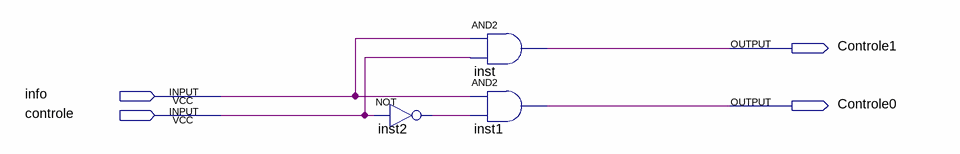
[diagram p0: schematic sheet]
// Quartus schematic Seletor.bdf as structural Verilog: 3 symbols, 4 pins
module Seletor (
  input  info,
  input  controle,
  output Controle1,
  output Controle0
);

  wire inst2_out;

  not inst2 (inst2_out, controle);
  and inst (Controle1, info, controle);
  and inst1 (Controle0, info, inst2_out);
endmodule
